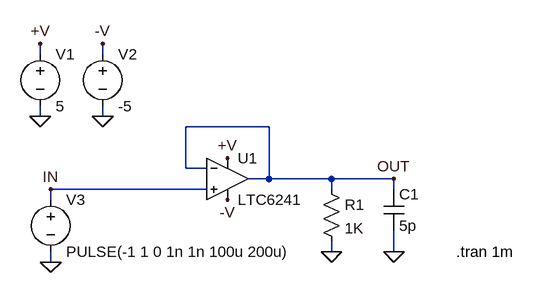
[diagram p0: schematic 6241.asc]
6241.asc, the LTspice schematic file:
Version 4
SHEET 1 880 680
WIRE -96 144 -96 128
WIRE 0 144 0 128
WIRE -96 240 -96 224
WIRE 0 240 0 224
WIRE 256 256 128 256
WIRE 128 320 128 256
WIRE 160 320 128 320
WIRE 256 336 256 256
WIRE 256 336 224 336
WIRE 352 336 256 336
WIRE 448 336 352 336
WIRE 160 352 -80 352
WIRE 352 352 352 336
WIRE 448 352 448 336
WIRE -80 368 -80 352
WIRE 352 448 352 432
WIRE 448 448 448 416
WIRE -80 464 -80 448
FLAG -96 240 0
FLAG 0 240 0
FLAG -80 464 0
FLAG -80 352 IN
FLAG 448 336 OUT
FLAG 352 448 0
FLAG 448 448 0
FLAG 0 128 -V
FLAG -96 128 +V
FLAG 192 304 +V
FLAG 192 368 -V
SYMBOL voltage -96 128 R0
SYMATTR InstName V1
SYMATTR Value 5
SYMBOL voltage 0 128 R0
SYMATTR InstName V2
SYMATTR Value -5
SYMBOL voltage -80 352 R0
SYMATTR InstName V3
SYMATTR Value PULSE(-1 1 0 1n 1n 100u 200u)
SYMBOL LTC6241 192 336 R0
SYMATTR InstName U1
SYMBOL res 336 336 R0
SYMATTR InstName R1
SYMATTR Value 1K
SYMBOL cap 432 352 R0
SYMATTR InstName C1
SYMATTR Value 5p
TEXT 544 448 Left 2 !.tran 1m

The netlist it stands for:
* 6241.asc
V1 +V 0 5
V2 -V 0 -5
V3 IN 0 PULSE(-1 1 0 1n 1n 100u 200u)
XU1 IN OUT +V -V OUT LTC6241  ; pins In+ In- V+ V- OUT
R1 OUT 0 1K
C1 OUT 0 5p
.tran 1m
.lib LTC4.lib
.backanno
.end